# Altium schematic sheet Res.SchDoc
size A4
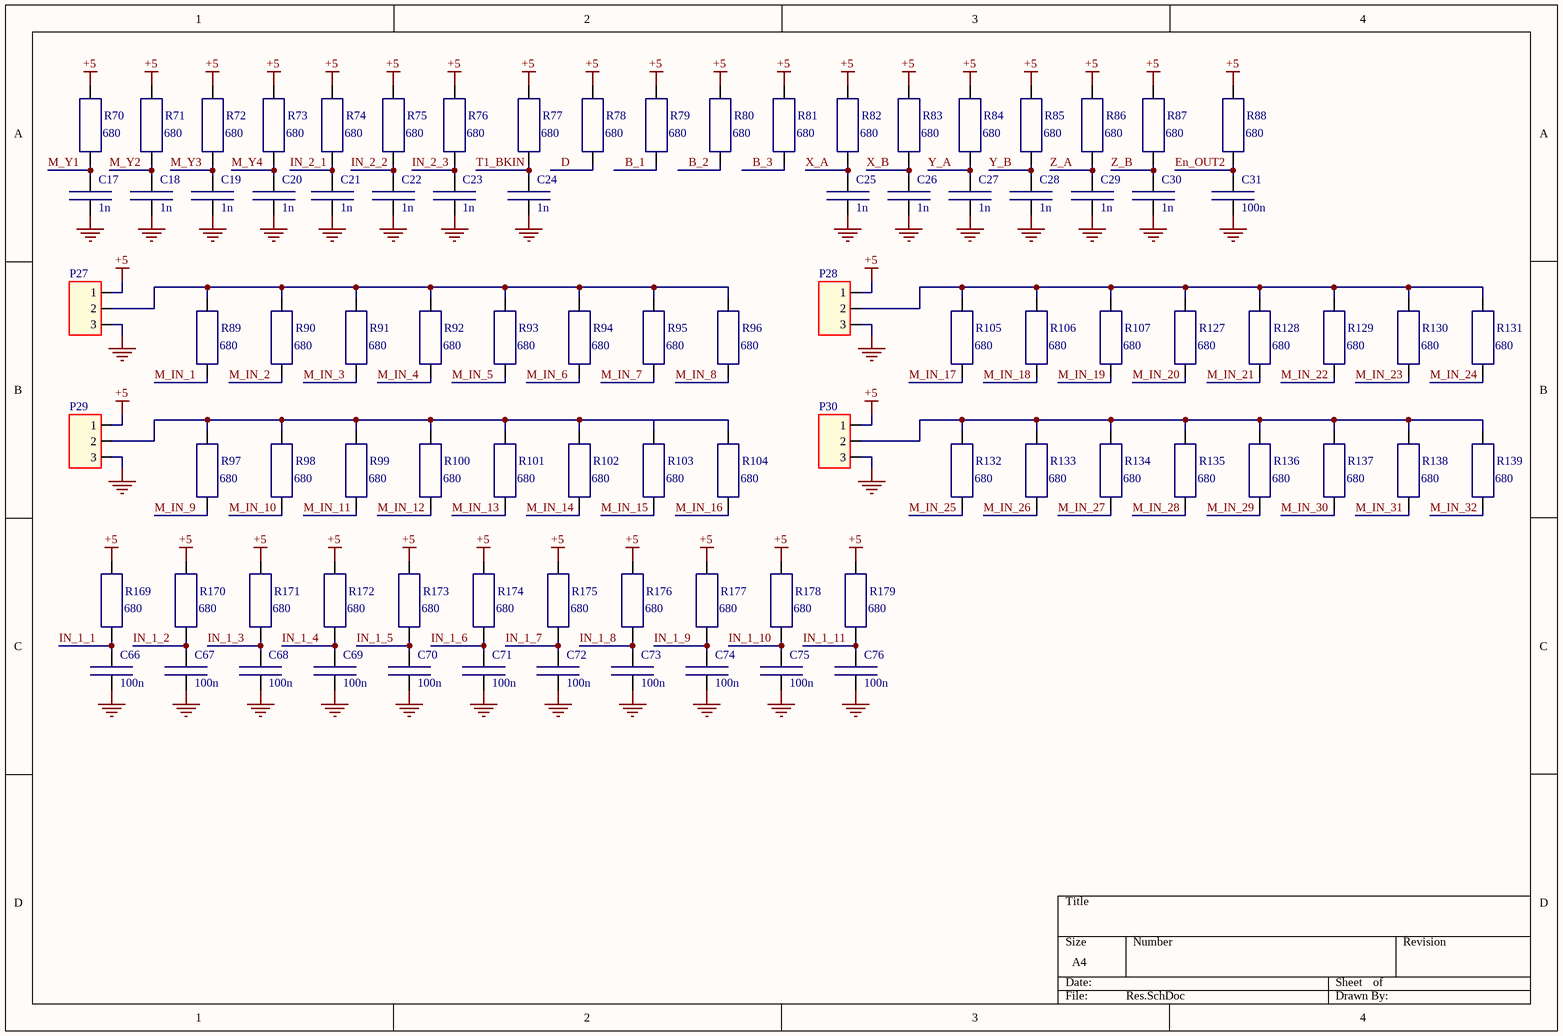
[diagram p0: Res.SchDoc]

## Parts
C17  1n  [C0805]
C18  1n  [C0805]
C19  1n  [C0805]
C20  1n  [C0805]
C21  1n  [C0805]
C22  1n  [C0805]
C23  1n  [C0805]
C24  1n  [C0805]
C25  1n  [C0805]
C26  1n  [C0805]
C27  1n  [C0805]
C28  1n  [C0805]
C29  1n  [C0805]
C30  1n  [C0805]
C31  100n  [C0805]
C66  100n  [C0805]
C67  100n  [C0805]
C68  100n  [C0805]
C69  100n  [C0805]
C70  100n  [C0805]
C71  100n  [C0805]
C72  100n  [C0805]
C73  100n  [C0805]
C74  100n  [C0805]
C75  100n  [C0805]
C76  100n  [C0805]
P27  Con_3  [CON_3]  (value not drawn)
P28  Con_3  [CON_3]  (value not drawn)
P29  Con_3  [CON_3]  (value not drawn)
P30  Con_3  [CON_3]  (value not drawn)
R70  680  [R0805]
R71  680  [R0805]
R72  680  [R0805]
R73  680  [R0805]
R74  680  [R0805]
R75  680  [R0805]
R76  680  [R0805]
R77  680  [R0805]
R78  680  [R0805]
R79  680  [R0805]
R80  680  [R0805]
R81  680  [R0805]
R82  680  [R0805]
R83  680  [R0805]
R84  680  [R0805]
R85  680  [R0805]
R86  680  [R0805]
R87  680  [R0805]
R88  680  [R0805]
R89  680  [R0805]
R90  680  [R0805]
R91  680  [R0805]
R92  680  [R0805]
R93  680  [R0805]
R94  680  [R0805]
R95  680  [R0805]
R96  680  [R0805]
R97  680  [R0805]
R98  680  [R0805]
R99  680  [R0805]
R100  680  [R0805]
R101  680  [R0805]
R102  680  [R0805]
R103  680  [R0805]
R104  680  [R0805]
R105  680  [R0805]
R106  680  [R0805]
R107  680  [R0805]
R127  680  [R0805]
R128  680  [R0805]
R129  680  [R0805]
R130  680  [R0805]
R131  680  [R0805]
R132  680  [R0805]
R133  680  [R0805]
R134  680  [R0805]
R135  680  [R0805]
R136  680  [R0805]
R137  680  [R0805]
R138  680  [R0805]
R139  680  [R0805]
R169  680  [R0805]
R170  680  [R0805]
R171  680  [R0805]
R172  680  [R0805]
R173  680  [R0805]
R174  680  [R0805]
R175  680  [R0805]
R176  680  [R0805]
R177  680  [R0805]
R178  680  [R0805]
R179  680  [R0805]

## Nets
+5: P27.1 P28.1 P29.1 P30.1 R70.2 R71.2 R72.2 R73.2 R74.2 R75.2 R76.2 R77.2 R78.2 R79.2 R80.2 R81.2 R82.2 R83.2 R84.2 R85.2 R86.2 R87.2 R88.2 R169.2 R170.2 R171.2 R172.2 R173.2 R174.2 R175.2 R176.2 R177.2 R178.2 R179.2
GND: C17.2 C18.2 C19.2 C20.2 C21.2 C22.2 C23.2 C24.2 C25.2 C26.2 C27.2 C28.2 C29.2 C30.2 C31.2 C66.2 C67.2 C68.2 C69.2 C70.2 C71.2 C72.2 C73.2 C74.2 C75.2 C76.2 P27.3 P28.3 P29.3 P30.3
B_1: R79.1
B_2: R80.1
B_3: R81.1
D: R78.1
En_OUT2: C31.1 R88.1
IN_1_1: C66.1 R169.1
IN_1_2: C67.1 R170.1
IN_1_3: C68.1 R171.1
IN_1_4: C69.1 R172.1
IN_1_5: C70.1 R173.1
IN_1_6: C71.1 R174.1
IN_1_7: C72.1 R175.1
IN_1_8: C73.1 R176.1
IN_1_9: C74.1 R177.1
IN_1_10: C75.1 R178.1
IN_1_11: C76.1 R179.1
IN_2_1: C21.1 R74.1
IN_2_2: C22.1 R75.1
IN_2_3: C23.1 R76.1
M_IN_1: R89.1
M_IN_2: R90.1
M_IN_3: R91.1
M_IN_4: R92.1
M_IN_5: R93.1
M_IN_6: R94.1
M_IN_7: R95.1
M_IN_8: R96.1
M_IN_9: R97.1
M_IN_10: R98.1
M_IN_11: R99.1
M_IN_12: R100.1
M_IN_13: R101.1
M_IN_14: R102.1
M_IN_15: R103.1
M_IN_16: R104.1
M_IN_17: R105.1
M_IN_18: R106.1
M_IN_19: R107.1
M_IN_20: R127.1
M_IN_21: R128.1
M_IN_22: R129.1
M_IN_23: R130.1
M_IN_24: R131.1
M_IN_25: R132.1
M_IN_26: R133.1
M_IN_27: R134.1
M_IN_28: R135.1
M_IN_29: R136.1
M_IN_30: R137.1
M_IN_31: R138.1
M_IN_32: R139.1
M_Y1: C17.1 R70.1
M_Y2: C18.1 R71.1
M_Y3: C19.1 R72.1
M_Y4: C20.1 R73.1
T1_BKIN: C24.1 R77.1
X_A: C25.1 R82.1
X_B: C26.1 R83.1
Y_A: C27.1 R84.1
Y_B: C28.1 R85.1
Z_A: C29.1 R86.1
Z_B: C30.1 R87.1
NetP27_2: P27.2 R89.2 R90.2 R91.2 R92.2 R93.2 R94.2 R95.2 R96.2
NetP28_2: P28.2 R105.2 R106.2 R107.2 R127.2 R128.2 R129.2 R130.2 R131.2
NetP29_2: P29.2 R97.2 R98.2 R99.2 R100.2 R101.2 R102.2 R103.2 R104.2
NetP30_2: P30.2 R132.2 R133.2 R134.2 R135.2 R136.2 R137.2 R138.2 R139.2

## Library data of the parts
C17-C31 C66-C76 = C0805
R70-R107 R127-R139 R169-R179 = R0805